# EAGLE design SolarCharger_Rev1_revised (EAGLE 7.6.0)
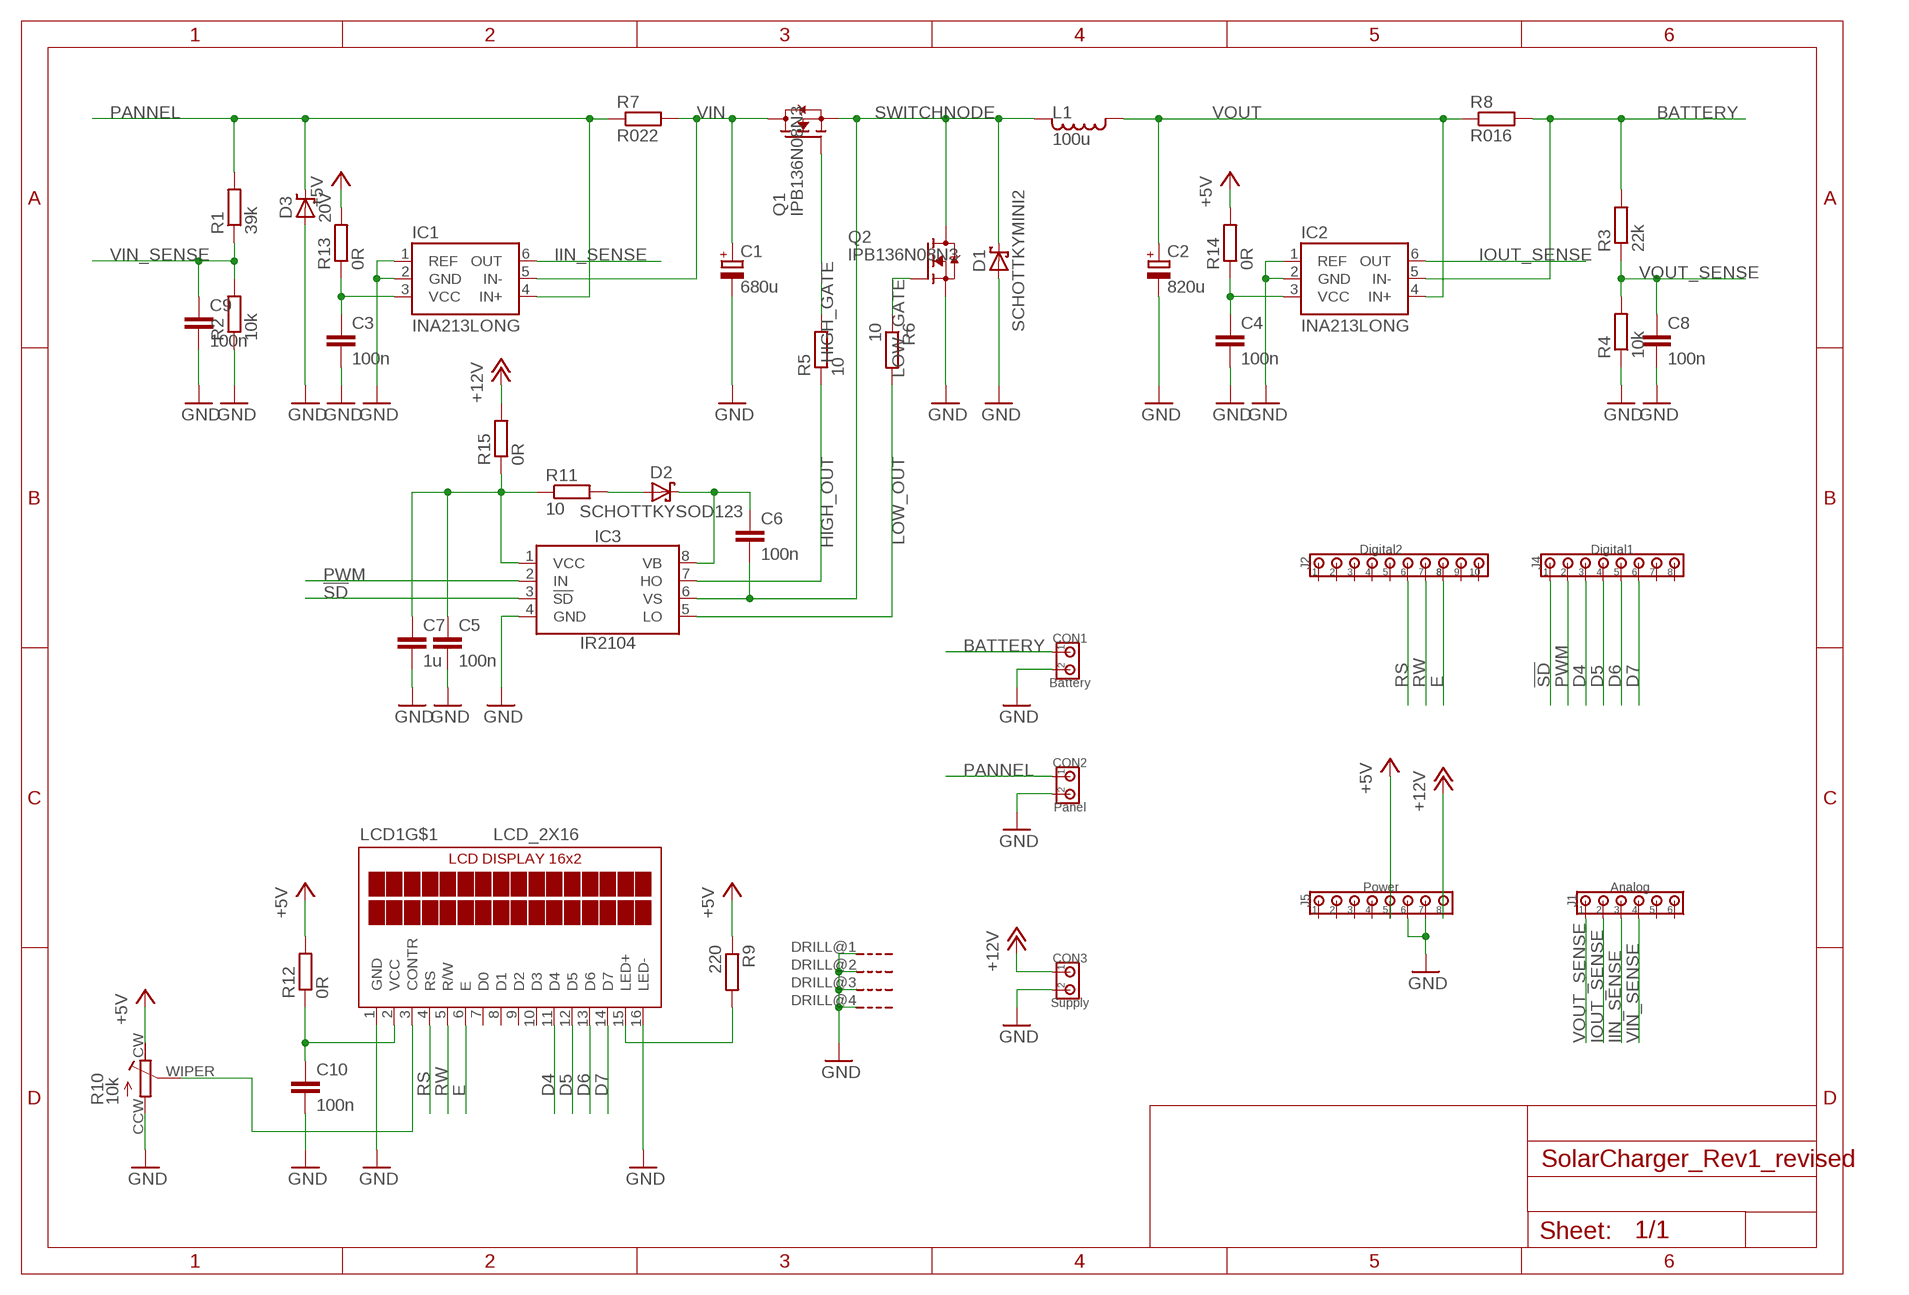
[diagram p0: schematic, sheet 1]

## Parts
C1  680u  C_POLARIZED10MM  [10MM]
C2  820u  C_POLARIZED10MM  [10MM]
C3  100n  CC0805  [C0805]
C4  100n  CC0805  [C0805]
C5  100n  CC0805  [C0805]
C6  100n  CC0805  [C0805]
C7  1u  CC0805  [C0805]
C8  100n  CC0805  [C0805]
C9  100n  CC0805  [C0805]
C10  100n  CC0805  [C0805]
CON1  Battery  CON_2X200MIL  [200MIL_2X]
CON2  Panel  CON_2X200MIL  [200MIL_2X]
CON3  Supply  CON_2X200MIL  [200MIL_2X]
D1  SCHOTTKYMINI2  [MINI2-F3-B]
D2  SCHOTTKYSOD123  [SOD123]
D3  20V  ZENERSMC  [SMC]
IC1  INA213LONG  [SC70-6_LONG]
IC2  INA213LONG  [SC70-6_LONG]
IC3  IR2104  [SOIC8]
J1  Analog  100MIL_6X  [100MIL_6X_ROUND]
J2  Digital2  100MIL_10X  [100MIL_10X_ROUND]
J4  Digital1  100MIL_8X  [100MIL_8X_ROUND]
J5  Power  100MIL_8X  [100MIL_8X_ROUND]
L1  100u  INDUCTORMSS1583  [MSS1583]
LCD1  LCD_2X16  [LCD_2X16]
Q1  IPB136N08N3  N-PWR-MOSFETTO263-3  [TO263-3]
Q2  IPB136N08N3  IPB136N08N3_GTO263  [TO263-3@1]
R1  39k  RESISTORR0805  [R0805]
R2  10k  RESISTORR0805  [R0805]
R3  22k  RESISTORR0805  [R0805]
R4  10k  RESISTORR0805  [R0805]
R5  10  RESISTORR0805  [R0805]
R6  10  RESISTORR0805  [R0805]
R7  R022  RESISTOR0612  [0612]
R8  R016  RESISTOR0612  [0612]
R9  220  RESISTORR0805  [R0805]
R10  10k  TRIMMER3314G  [RTRIM3314G]
R11  10  RESISTORR0805  [R0805]
R12  0R  RESISTORR0805  [R0805]
R13  0R  RESISTORR0805  [R0805]
R14  0R  RESISTORR0805  [R0805]
R15  0R  RESISTORR0805  [R0805]

## Nets
!SD!: IC3.3(!SD!) J4.1
+5V: J5.5 R9.1 R10.CW R12.2 R13.2 R14.2
+12V: CON3.1 J5.8 R15.2
BATTERY: CON1.1 IC2.5(IN-) R3.2 R8.2
BOOT: C6.1 D2.C IC3.8(VB)
D4: J4.3 LCD1.11(D4)
D5: J4.4 LCD1.12(D5)
D6: J4.5 LCD1.13(D6)
D7: J4.6 LCD1.14(D7)
E: J2.8 LCD1.6(E)
GND: C1.- C2.- C3.2 C4.2 C5.2 C7.2 C8.2 C9.2 C10.2 CON1.2 CON2.2 CON3.2 D1.A D3.A IC1.1(REF) IC1.2(GND) IC2.1(REF) IC2.2(GND) IC3.4(GND) J5.6 J5.7 LCD1.1(GND) LCD1.16(LED-) LCD1.DRILL@1(G) LCD1.DRILL@2(G) LCD1.DRILL@3(G) LCD1.DRILL@4(G) Q2.3(S) R2.1 R4.1 R10.CCW
HIGH_GATE: Q1.1(G) R5.2
HIGH_OUT: IC3.7(HO) R5.1
IIN_SENSE: IC1.6(OUT) J1.3
IOUT_SENSE: IC2.6(OUT) J1.2
LOW_GATE: Q2.1(G) R6.1
LOW_OUT: IC3.5(LO) R6.2
N$1: C10.1 LCD1.2(VCC) R12.1
N$2: C3.1 IC1.3(VCC) R13.1
N$3: C4.1 IC2.3(VCC) R14.1
N$5: C5.1 C7.1 IC3.1(VCC) R11.1 R15.1
N$9: LCD1.15(LED+) R9.2
N$10: LCD1.3(CONTR) R10.WIPER
N$11: D2.A R11.2
PANNEL: CON2.1 D3.C IC1.4(IN+) R1.2 R7.1
PWM: IC3.2(IN) J4.2
RS: J2.6 LCD1.4(RS)
RW: J2.7 LCD1.5(R/W)
SWITCHNODE: C6.2 D1.C IC3.6(VS) L1.2 Q1.3(S) Q2.TAB(D)
VIN: C1.+ IC1.5(IN-) Q1.TAB(D) R7.2
VIN_SENSE: C9.1 J1.4 R1.1 R2.2
VOUT: C2.+ IC2.4(IN+) L1.1 R8.1
VOUT_SENSE: C8.1 J1.1 R3.1 R4.2
Unconnected: J1.5 J1.6 J2.1 J2.2 J2.3 J2.4 J2.5 J2.9 J2.10 J4.7 J4.8 J5.1 J5.2 J5.3 J5.4 LCD1.7(D0) LCD1.8(D1) LCD1.9(D2) LCD1.10(D3)

## Library data of the parts
C1 C2 = 00Capacitor:C_POLARIZED
C3-C10 = 00Capacitor:C: Capacitor
CON1-CON3 = 00Connector:CON_2X: 2-pin header
D1 D2 = 00Diode:SCHOTTKY
D3 = 00Diode:ZENER
IC1 IC2 = 00Sensor:INA21*: Current-Shunt Monitors Voltage Output, Low- or High-Side Measurement, Bidirectional, Zero-Drift Series; GAIN: 50
IC3 = 00Logic:IR2104: Half-Bridge Driver Up to +600V Gate drive supply 10-20V Deadtime 520ns
J1 = 00Connector:100MIL_6X: 100 mil 6-pin connector
J2 = 00Connector:100MIL_10X: 100mil 10-pin connector
J4 J5 = 00Connector:100MIL_8X: 100 mil 8-pin connector
L1 = 00Inductor:INDUCTOR
LCD1 = 00Display:LCD_2X16
Q1 = 00Mosfet:N-PWR-MOSFET
Q2 = 00Mosfet:IPB136N08N3_G
R1-R9 R11-R15 = 00Resistor:RESISTOR: RESISTOR, European symbol
R10 = 00Resistor:TRIMMER

## Board
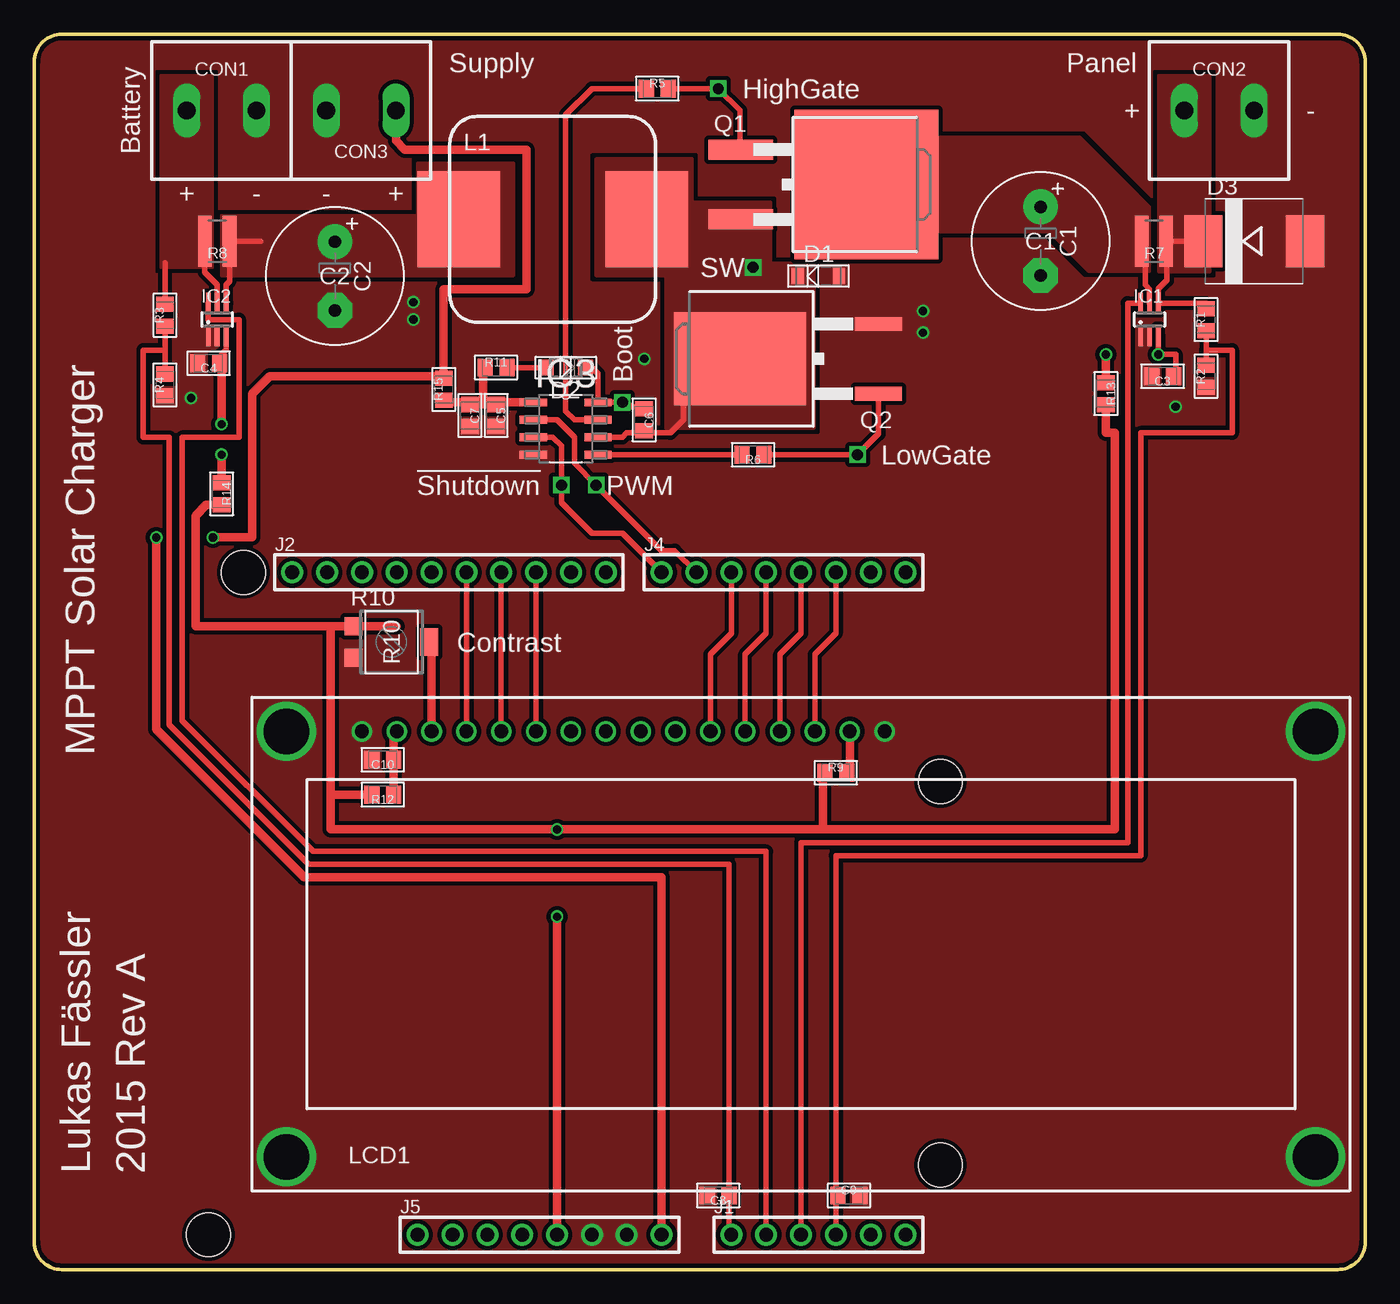
[diagram p1: board, top side]
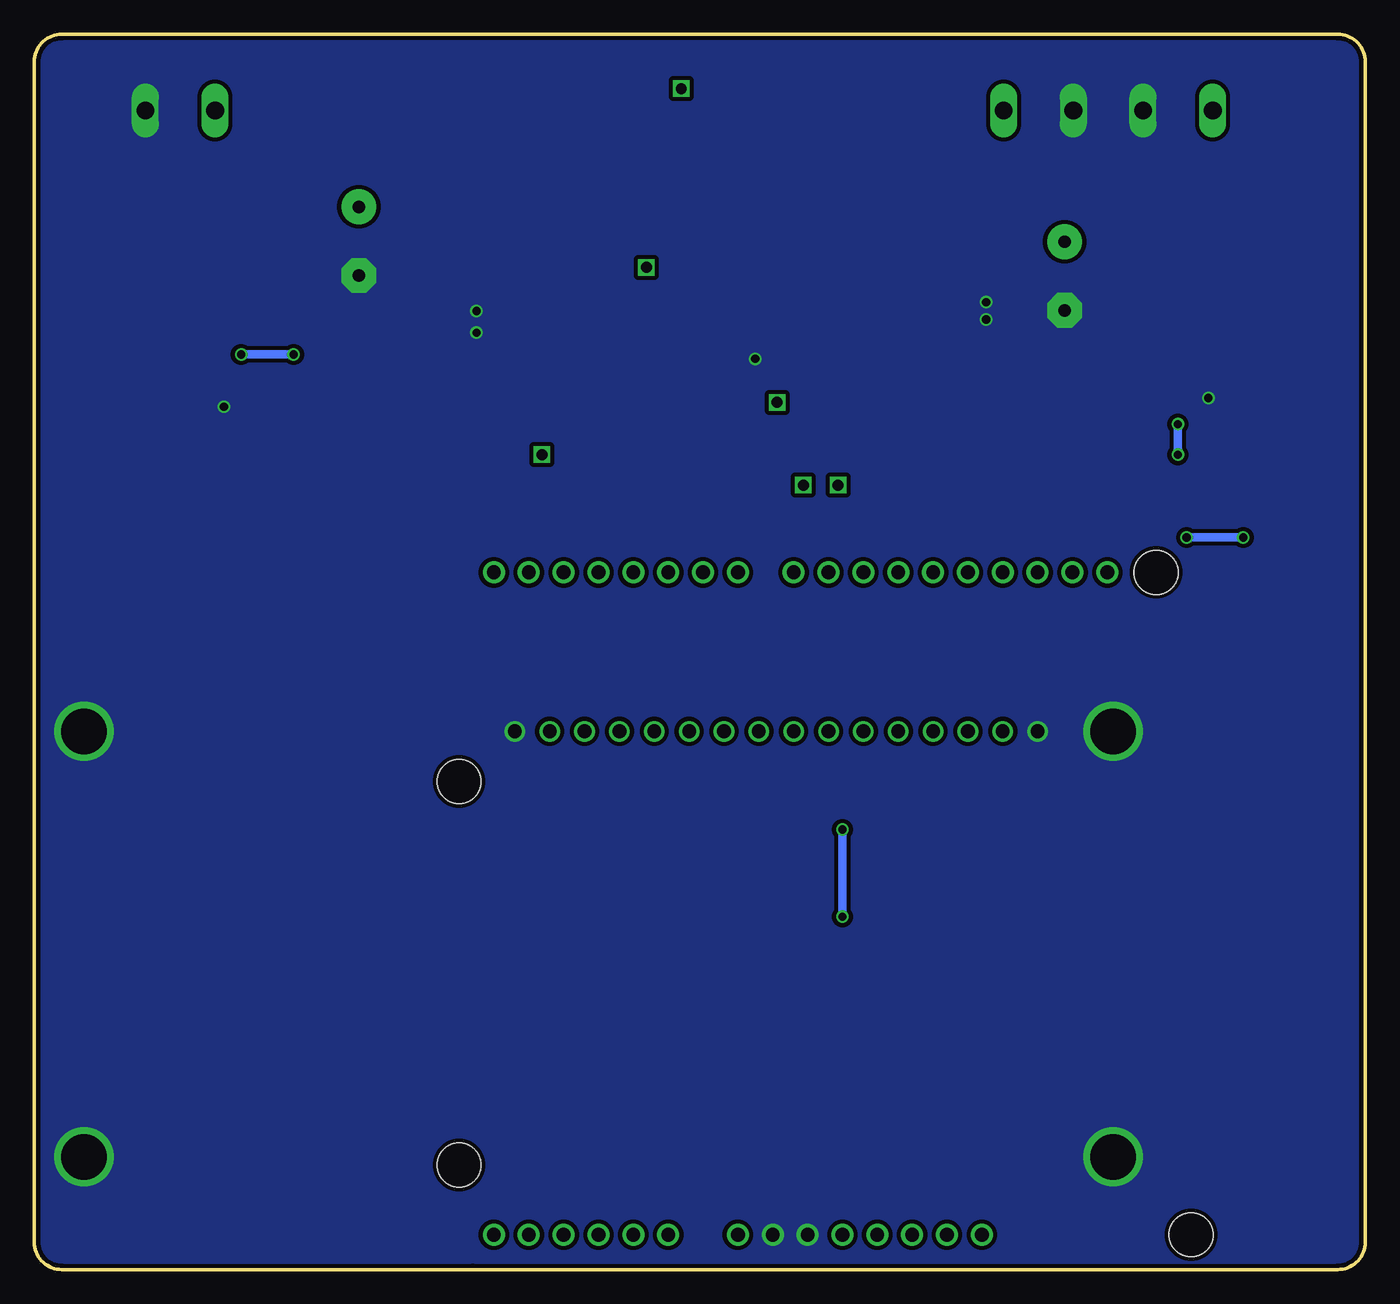
[diagram p2: board, bottom side, seen from below]

Size 97 x 90 mm. Coordinates in mm from the lower left corner, seen from the top.
Outline: 65.04,0 95,0 arc90 97,2 97,88 arc90 95,90 2,90 arc90 0,88 0,2 arc90 2,0 65.02,0
Outline: 65.02,0 arc-90 65.04,0
Outline: 65.04,0 65.02,0
Copper layers (1*16): Top 0.035mm / dielectric 1.5mm / Bottom 0.035mm
Design rules "dirt_cheap_dirty_boards.8mil": minimum track width 5mil, minimum drill 12mil, track to track 8mil, track to pad 8mil, pad to pad 8mil, via to via 8mil, smd to smd 0mil, copper to edge 10mil, drill to drill 10mil, minimum pad ring 8mil, minimum via ring 6mil, stop-mask expansion 2mil, vias tented up to drill 25mil, thermal gap 10mil
Holes 3.2 mm at 15.24,50.8 66.04,7.62 66.04,35.56 12.7,2.54

### Footprints (pad centres in the part's own frame; a part is rotated, then mirrored left to right if it is on the bottom)
10MM = drill 0.9 pad 2.54: + -2.5,0 | drill 0.9 pad 2.54 octagon: - 2.5,0
C0805 = smd 1.1 x 1.3: 1 -0.8,0; 2 0.8,0
200MIL_2X = drill 1.3 long: 1 -2.54,0; 2 2.54,0
MINI2-F3-B = smd 0.9 x 1.2: A 1.5,0; C -1.5,0
SOD123 = smd 1.1 x 1.1: A 1.45,0; C -1.45,0
SMC = smd 2.8 x 3.8: A 3.7,0; C -3.7,0
SC70-6_LONG = smd 0.35 x 1.5: 1 -0.65,-1.2; 2 0,-1.2; 3 0.65,-1.2; 4 0.65,1.2; 5 0,1.2; 6 -0.65,1.2
SOIC8 = smd 1.981 x 0.559: 1 -2.362,1.905; 2 -2.362,0.635; 3 -2.362,-0.635; 4 -2.362,-1.905; 5 2.362,-1.905; 6 2.362,-0.635; 7 2.362,0.635; 8 2.362,1.905
100MIL_6X_ROUND = drill 1 pad 1.6: 1 -6.35,0; 2 -3.81,0; 3 -1.27,0; 4 1.27,0; 5 3.81,0; 6 6.35,0
100MIL_10X_ROUND = drill 1 pad 1.6: 1 -8.89,0; 2 -6.35,0; 3 -3.81,0; 4 -1.27,0; 5 1.27,0; 6 3.81,0; 7 6.35,0; 8 8.89,0; 9 11.43,0; 10 13.97,0
100MIL_8X_ROUND = drill 1 pad 1.6: 1 -8.89,0; 2 -6.35,0; 3 -3.81,0; 4 -1.27,0; 5 1.27,0; 6 3.81,0; 7 6.35,0; 8 8.89,0
MSS1583 = smd 6 x 7: 1 -6.85,0; 2 6.85,0
LCD_2X16 = drill 1: 1 8,33.5; 2 10.54,33.5; 3 13.08,33.5; 4 15.62,33.5; 5 18.16,33.5; 6 20.7,33.5; 7 23.24,33.5; 8 25.78,33.5; 9 28.32,33.5; 10 30.86,33.5; 11 33.4,33.5; 12 35.94,33.5; 13 38.48,33.5; 14 41.02,33.5; 15 43.56,33.5; 16 46.1,33.5 | drill 3.3: DRILL@1 2.5,33.5; DRILL@2 77.5,33.5; DRILL@3 77.5,2.5; DRILL@4 2.5,2.5
TO263-3 = smd 1.45 x 4.7: 1 -2.54,-5.65; 3 2.54,-5.65 | smd 10.9 x 10.5: TAB 0,3.5
TO263-3@1 = smd 1 x 3.4: 1 -2.54,-6.6; 3 2.54,-6.6 | smd 6.8 x 9.6: TAB 0,3.5
R0805 = smd 1.1 x 1.3: 1 -0.8,0; 2 0.8,0
0612 = smd 1 x 3.7: 1 -0.9,0; 2 0.9,0
RTRIM3314G = smd 1.3 x 1.3: CCW 1.15,-2.75; CW -1.15,-2.75 | smd 2 x 1.3: WIPER 0,2.75

### Placement (x,y rotation side)
C1  73.34,74.93 270 top
C2  21.91,72.39 270 top
C3  82.23,65.09 180 top
C4  12.7,66.04 180 top
C5  33.66,62.23 270 top
C6  44.45,61.91 270 top
C7  31.75,62.23 270 top
C8  49.85,5.4 180 top
C9  59.37,5.4 0 top
C10  25.4,37.15 180 top
CON1  13.65,84.45 0 top
CON2  86.36,84.45 0 top
CON3  23.81,84.45 180 top
D1  57.15,72.39 0 top
D2  38.73,65.72 180 top
D3  88.9,74.93 0 top
IC1  81.28,69.22 0 top
IC2  13.34,69.22 0 top
IC3  38.73,61.28 0 top
J1  57.15,2.54 0 top
J2  27.69,50.8 0 top
J4  54.61,50.8 0 top
J5  36.83,2.54 0 top
L1  37.78,76.52 0 top
LCD1  15.88,5.71 0 top
Q1  57.15,79.06 270 top
Q2  54.93,66.36 90 top
R1  85.41,69.22 90 top
R2  85.41,65.09 90 top
R3  9.53,69.53 90 top
R4  9.53,64.45 90 top
R5  45.4,86.04 0 top
R6  52.39,59.37 180 top
R7  81.6,74.93 180 top
R8  13.34,74.93 180 top
R9  58.42,36.2 0 top
R10  26.04,45.72 270 top
R11  33.66,65.72 0 top
R12  25.4,34.61 180 top
R13  78.11,63.82 270 top
R14  13.65,56.52 270 top
R15  29.84,64.14 90 top

### Tracks (layer width: path | path; a pad name or v marks a point on that pad's centre or on a via)
!SD!  (via drill 0.8)
  Top 0.406: IC3.3 37.78,60.64 38.42,60.01 v38.42,57.15 38.42,55.88 40.64,53.66 42.86,53.66 J4.1
+5V  (via drill 0.6)
  Top 0.61: 26.41,46.87 R10.CW 21.59,46.87 | J5.5 v38.1,25.72 | 21.59,46.87 11.75,46.87 11.75,54.93 12.54,55.72 R14.2 | 57.47,32.07 78.74,32.07 78.74,60.96 78.11,60.96 R13.2 | 57.47,32.07 v38.1,32.07 21.59,32.07 21.59,34.61 | R9.1 57.47,36.2 57.47,32.07 | 21.59,34.61 21.59,46.87 | R12.2 21.59,34.61
  Bottom 0.61: v38.1,25.72 v38.1,32.07
+12V  (via drill 0.6)
  Top 0.61: v13.02,53.34 15.88,53.34 15.88,63.82 17.14,65.09 29.69,65.09 R15.2 29.84,71.44 35.88,71.44 35.88,81.6 26.99,81.6 26.35,82.23 CON3.1 | v8.89,53.34 8.89,39.37 19.68,28.57 45.72,28.57 J5.8
  Bottom 0.61: v13.02,53.34 v8.89,53.34
BATTERY
  Top 0.406: IC2.5 13.34,71.75 12.44,72.66 R8.2 | R3.2 9.53,73.34
  pour Top (isolate 0.305, no thermals): 13.02,73.03 13.02,87 9.21,87 9.21,73.03
BOOT  (via drill 0.8)
  Top 0.406: C6.1 44.3,62.87 43.5,62.87 43.18,63.18 v42.86,63.18 IC3.8 41.1,65.27 40.64,65.72 D2.C
D4
  Top 0.406: J4.3 50.8,46.35 49.27,44.83 LCD1.11
D5
  Top 0.406: J4.4 53.34,46.35 51.81,44.83 LCD1.12
D6
  Top 0.406: J4.5 55.88,46.35 54.35,44.83 LCD1.13
D7
  Top 0.406: J4.6 58.42,46.35 56.9,44.83 LCD1.14
E
  Top 0.406: LCD1.6 J2.8
GND  (via drill 0.6)
  other vias: 44.45,66.36 27.62,70.48 27.62,69.22 83.19,62.87 11.43,63.5 64.77,69.85 64.77,68.26
  pour Top (isolate 0.305, rank 2, no thermals): 2,90 95,90 arc-90 97,88 97.04,2 arc-91 95,0 2,0 arc-90 0,2 0,88 arc-90
  pour Bottom (isolate 0.305, rank 2, no thermals): 0,88 arc-90 2,90 95,90 arc-90 97,88 97,2 arc-90 95,0 2,0 arc-90 0,2
HIGH_GATE  (via drill 0.8)
  Top 0.406: R5.2 v49.85,86.04 51.44,84.45 51.44,81.66 Q1.1
HIGH_OUT
  Top 0.406: IC3.7 39.37,61.91 38.73,62.55 38.73,84.14 40.64,86.04 R5.1
IIN_SENSE
  Top 0.406: IC1.6 79.69,70.42 79.69,31.11 55.88,31.11 J1.3
IOUT_SENSE
  Top 0.406: IC2.6 12.69,69.22 14.92,69.22 14.92,60.64 10.79,60.64 10.79,40.01 20.32,30.48 53.34,30.48 J1.2
LOW_GATE  (via drill 0.6, 0.8)
  Top 0.406: R6.1 v60.01,59.37 61.53,60.89 Q2.1
LOW_OUT
  Top 0.406: IC3.5 R6.2
N$1
  Top 0.61: R12.1 C10.1 26.2,39 LCD1.2
N$2  (via drill 0.6)
  Top 0.406: IC1.3 v81.93,66.67 | v81.93,66.67 83.19,66.67 83.19,65.09 C3.1 | v81.93,66.67 v81.92,66.67
  Top 0.61: R13.1 v78.11,66.67
  Bottom 0.61: v81.92,66.67 v78.11,66.67
N$3  (via drill 0.6)
  Top 0.406: IC2.3 13.98,67.01 13.65,66.67 13.65,66.19 C4.1
  Top 0.61: v13.65,61.59 v13.65,61.6 13.65,66.04 C4.1 | v13.65,59.37 R14.1
  Bottom 0.61: v13.65,61.59 v13.65,59.37
N$5
  Top 0.61: IC3.1 33.81,63.18 C5.1 32.7,63.03 | R11.1 32.7,65.72 32.7,63.03 | 32.7,63.03 C7.1 31.75,63.19 30,63.19 R15.1
N$9
  Top 0.61: LCD1.15 59.44,36.41 R9.2
N$10
  Top 0.61: LCD1.3 28.95,45.55 R10.WIPER
N$11
  Top 0.406: R11.2 D2.A
PANNEL
  Top 0.406: D3.C R7.1 82.55,74.56 82.55,72.07 81.93,71.45 IC1.4 85.41,70.42 R1.2
  pour Top (isolate 0.305, no thermals): 85.72,72.71 85.72,87 81.92,87 81.92,72.71
PWM  (via drill 0.8)
  Top 0.406: IC3.2 38.1,61.91 39.37,60.64 39.37,58.74 v40.96,57.15 45.72,52.39 46.67,52.39 J4.2
RS
  Top 0.406: LCD1.4 J2.6
RW
  Top 0.406: LCD1.5 J2.7
SWITCHNODE  (via drill 0.8)
  Top 0.406: Q2.TAB 47.31,66.36 47.31,61.91 46.36,60.96 44.6,60.96 C6.2 44.3,60.96 43.18,60.96 42.86,60.64 IC3.6
  other vias: 52.39,73.03
  pour Top (isolate 0.305, no thermals): 40.96,80.96 47.94,80.96 47.94,77.79 53.66,77.79 53.66,73.34 56.83,73.34 56.83,61.28 46.04,61.28 46.04,72.39 40.96,72.39
VIN
  Top 0.406: IC1.5 81.28,71.44 80.96,71.75 80.96,74.35 R7.2
  pour Top (isolate 0.305, no thermals): 81.28,77.47 81.28,72.71 76.83,72.71 73.98,75.56 56.83,75.56 56.83,82.55 76.2,82.55
VIN_SENSE
  Top 0.406: R1.1 85.41,66.99 | 85.41,66.99 87.31,66.99 87.31,60.96 80.64,60.96 80.64,30.16 58.42,30.16 58.42,5.4 | R2.2 85.41,66.99 | 58.42,5.4 J1.4 | C9.1 58.42,5.4
VOUT
  Top 0.406: IC2.4 13.98,71.74 13.97,71.75 14.23,72.02 R8.1 16.5,74.93
  pour Top (isolate 0.305, no thermals): 34.92,80.64 34.92,72.39 13.65,72.39 13.65,76.83 27.94,76.83 27.94,80.64
VOUT_SENSE
  Top 0.406: R4.2 9.53,66.99 | 9.53,66.99 R3.1 | 9.53,66.99 7.94,66.99 7.94,60.64 9.84,60.64 9.84,39.69 20,29.53 50.65,29.53 C8.1 50.65,2.54 J1.1

### Text on the board
tPlace: Supply | Panel | HighGate | Battery | + | - | + | - | - | + | SW | Boot | LowGate | !Shutdown! | PWM | Contrast | MPPT Solar Charger | Lukas Fässler | 2015 Rev A